# Altium schematic sheet 2_STM32KIT_UART.SchDoc
size 381 x 241 mm; SheetNumber: 1; SheetTotal: 4
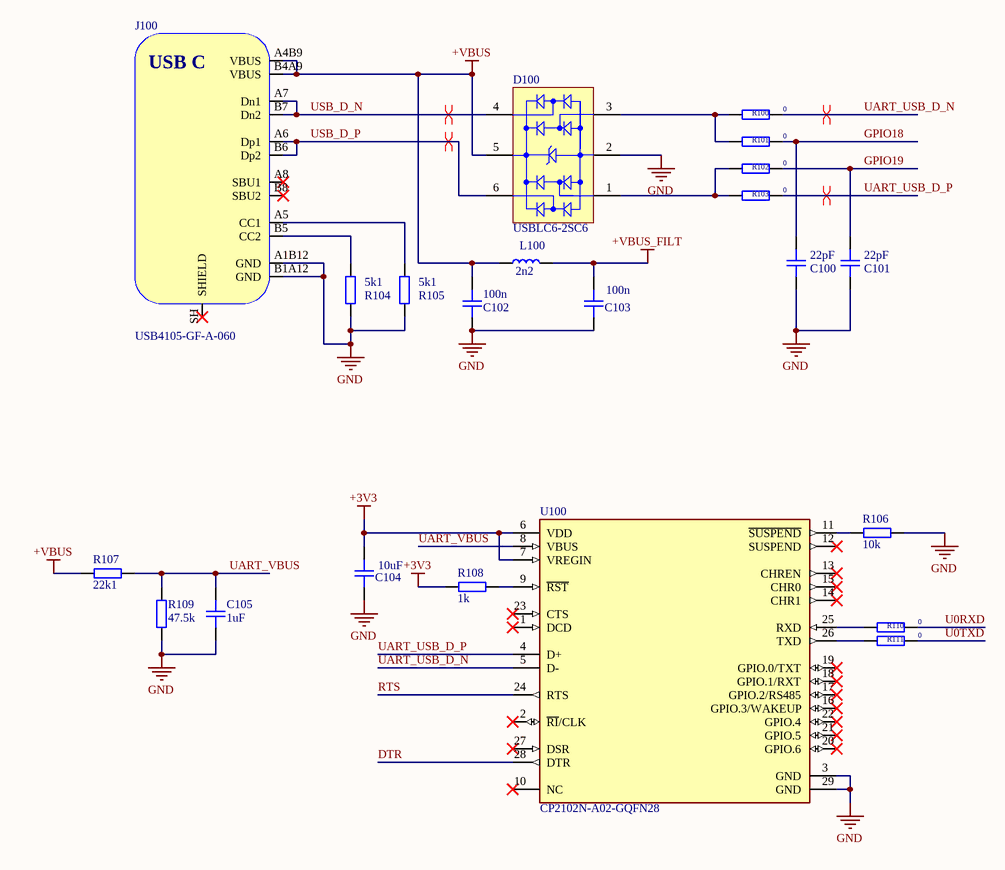
[diagram p0: 2_STM32KIT_UART.SchDoc]

## Parts
C100  22pF  [CAP_0402]
C101  22pF  [CAP_0402]
C102  100n  [CAP_0603]
C103  100n  [CAP_0603]
C104  10uF  [CAP_0402]
C105  1uF  [CAP_0402]
D100  USBLC6-2SC6  [STM-SOT23-6L_V]
J100  USB4105-GF-A-060  [USB4105-GF-A-060]
L100  2n2  [IND_0603]
R100  0  [RES_0402]
R101  0  [RES_0402]
R102  0  [RES_0402]
R103  0  [RES_0402]
R104  5k1  [RES_0603]
R105  5k1  [RES_0603]
R106  10k  [RES_0402]
R107  22k1  [RES_0402]
R108  1k  [RES_0402]
R109  47.5k  [RES_0402]
R110  0  [RES_0402]
R111  0  [RES_0402]
U100  CP2102N-A02-GQFN28  [FP-CP2102N-A02-GQFN28-MFG]

## Nets
+3V3: C104.2 R108.1 U100.6(VDD) U100.7(VREGIN)
+VBUS: C102.2 D100.5(VBUS) J100.A4B9(VBUS) J100.B4A9(VBUS) L100.1 R107.2
+VBUS_FILT: C103.2 L100.2
GND: C100.1 C101.1 C102.1 C103.1 C104.1 C105.1 D100.2(GND) J100.A1B12(GND) J100.B1A12(GND) R104.1 R105.1 R106.2 R109.2 U100.3(GND) U100.29(GND)
DTR: U100.28(DTR)
GPIO18: C100.2 R101.2
GPIO19: C101.2 R102.2
RTS: U100.24(RTS)
U0RXD: R110.2
U0TXD: R111.2
UART_USB_D_N: R100.2 U100.5(D-)
UART_USB_D_P: R103.2 U100.4(D+)
UART_VBUS: C105.2 R107.1 R109.1 U100.8(VBUS)
USB_D_N: D100.4(I/O_3) J100.A7(Dn1) J100.B7(Dn2)
USB_D_P: D100.6(I/O_4) J100.A6(Dp1) J100.B6(Dp2)
NetD100_1: D100.1(I/O_1) R102.1 R103.1
NetD100_3: D100.3(I/O_2) R100.1 R101.1
NetJ100_A5: J100.A5(CC1) R105.2
NetJ100_B5: J100.B5(CC2) R104.2
NetR106_1: R106.1 U100.11(~{SUSPEND})
NetR108_2: R108.2 U100.9(~{RST})
NetR110_1: R110.1 U100.25(RXD)
NetR111_1: R111.1 U100.26(TXD)

Not connected (* = marked no-connect by the designer): J100 A8(SBU1)* B8(SBU2)* SH(SHIELD)*; U100 1(DCD)* 2(~{RI}/CLK)* 10(NC)* 12(SUSPEND)* 13(CHREN)* 14(CHR1)* 15(CHR0)* 16(GPIO.3/WAKEUP)* 17(GPIO.2/RS485)* 18(GPIO.1/RXT)* 19(GPIO.0/TXT)* 20(GPIO.6)* 21(GPIO.5)* 22(GPIO.4)* 23(CTS)* 27(DSR)*

## Layout directives
differential pair: UART_USB_D_N, UART_USB_D_P, USB_D_N, USB_D_P

## Notes on the sheet
- (in symbol CMP-002-00129-1) USB C

## Library data of the parts
C100 C101 C104 C105 = CMP-001-00086-1: Capacitor SMD 0402; Manufacturer: *; Distributor Link: *; Manufacturer Part Number: *; Design Item ID: CAP_0402; Dielectric: *; LCSC: *; Source: Schematic-Lib-PhilsLab.SchLib; Rating: *
C102 C103 = CMP-001-00087-1: Capacitor SMD 0603; Manufacturer Part Number: *; Distributor Link: *; Manufacturer: *; Rating: *; Design Item ID: CAP_0603; Source: Schematic-Lib-PhilsLab.SchLib; Dielectric: *; LCSC: *
D100 = CMP-2000-05378-1: Very low capacitance ESD protection, 3.5 pF, -40 to 125 degC, 6-Pin SOT23, RoHS, Tape and Reel; Manufacturer: STMicroelectronics; Polarity: Uni-Directional; Clamping Voltage: 17V; Rad Hardened: No; Product Height (mm): 1.3mm; Leakage Current (Max): 0.15uA; Product Length (mm): 3.05mm; Number of Elements: 1; Peak Pulse Current: 5A; Configuration: Dual; Reverse Breakdown Voltage: 6V; Working Voltage (Max): 5V; Capacitance Value: 3.5pF; Suppressor Type: DiodeArrays; Product Depth (mm): 1.75mm; Test Current (It): 1mA; Package / Case: SOT-23; Operating Temperature Max Deg. C: 125C; Package Description: 6-Pin Small Outline Transistor, Body 2.925 x 1.625 mm, Pitch 0.95 mm; Package Reference: SOT23-6L; Datasheet Version: Rev. 5, 10/2011; Operating Temperature Min Deg. C: -40C; Mounting Style: SurfaceMount; Direction Type: Uni-Directional; Mounting: SurfaceMount; Pin Count: 6; Leakage Current: 0.15uA; Packaging: TapeandReel; Operating Temperature Classification: Automotive; Clamping Voltage (Max): 17V; Manufacturer URL: http://www.st.com/; Reverse Stand-off Voltage: 5V; Datasheet URL: http://www.st.com/st-web-ui/static/active/en/resource/technical/document/datasheet/CD00050750.pdf; Working Voltage: 5V; Operating Temp Range: -40Cto125C; LCSC: C7519
J100 = CMP-002-00129-1: USB Connector Type C SMT 12 Pin; Manufacturer: GCT; Distributor Link: https://eu.mouser.com/ProductDetail/GCT/USB4105-GF-A-060?qs=QNEnbhJQKvY2mocwNJzgfA%3D%3D; Source: Schematic-Lib-PhilsLab.SchLib; Manufacturer Part Number: USB4105-GF-A-060; Design Item ID: USB4105-GF-A-060
L100 = CMP-006-00026-1: Inductor SMD 0603; Design Item ID: IND_0603; Source: Schematic-Lib-PhilsLab.SchLib
R100-R103 R106-R111 = CMP-009-00182-1: Resistor SMD 0402; Distributor Link: *; Source: Schematic-Lib-PhilsLab.SchLib; Manufacturer Part Number: *; LCSC: *; Design Item ID: RES_0402; Manufacturer: *
R104 R105 = CMP-009-00183-1: Resistor SMD 0603; Manufacturer Part Number: *; Distributor Link: *; LCSC: *; Source: Schematic-Lib-PhilsLab.SchLib; Manufacturer: *; Design Item ID: RES_0603
U100 = CMP-08093-000005-1: IC USB TO UART BRIDGE QFN28